# EAGLE design untitled (EAGLE 8.2.2)

## Sheet 1 of 2
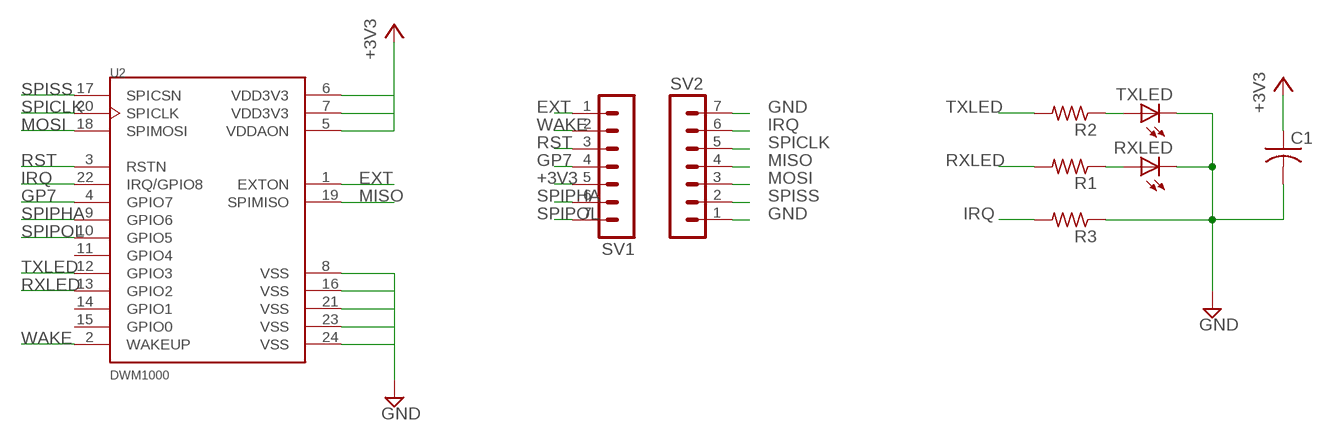
[diagram p0: schematic, sheet 1]

### Parts
C1  C-USC1206  [C1206]
R1  R-US_R1206  [R1206]
R2  R-US_R1206  [R1206]
R3  R-US_R1206  [R1206]
RXLED  LEDSMT1206  [1206]
SV1  MA07-1  [MA07-1]
SV2  MA07-1  [MA07-1]
TXLED  LEDSMT1206  [1206]
U2  DWM1000  [XCVR_DWM1000]

### Nets
+3V3: C1.1 SV1.5 U2.5(VDDAON) U2.6(VDD3V3) U2.7(VDD3V3)
EXT: SV1.1 U2.1(EXTON)
GND: C1.2 R3.1 RXLED.C SV2.1 SV2.7 TXLED.C U2.8(VSS) U2.16(VSS) U2.21(VSS) U2.23(VSS) U2.24(VSS)
GP7: SV1.4 U2.4(GPIO7)
IRQ: R3.2 SV2.6 U2.22(IRQ/GPIO8)
MISO: SV2.4 U2.19(SPIMISO)
MOSI: SV2.3 U2.18(SPIMOSI)
N$1: R1.1 RXLED.A
N$2: R2.1 TXLED.A
RST: SV1.3 U2.3(RSTN)
RXLED: R1.2 U2.13(GPIO2)
SPICLK: SV2.5 U2.20(SPICLK)
SPIPHA: SV1.6 U2.9(GPIO6)
SPIPOL: SV1.7 U2.10(GPIO5)
SPISS: SV2.2 U2.17(SPICSN)
TXLED: R2.2 U2.12(GPIO3)
WAKE: SV1.2 U2.2(WAKEUP)
Unconnected: U2.11(GPIO4) U2.14(GPIO1) U2.15(GPIO0)

## Sheet 2 of 2

## Library data of the parts
C1 = rcl:C-US: CAPACITOR, American symbol
R1-R3 = rcl:R-US_: RESISTOR, American symbol
RXLED TXLED = led:LED: LED OSRAM: - CHIPLED LG R971, LG N971, LY N971, LG Q971, LY Q971, LO R971, LY R971 LH N974, LH R974 LS Q976, LO Q976, LY Q976 LO Q996 - Hyper CHIPLED LW Q18S LB Q993, LB Q99A, LB R99A - SideLED LS A670, LO A670, LY A670, LG A670, LP A670 LB A673, LV A673, LT A673, LW A673 LH A674 LY A675 LS A676, LA A676, LO A676, LY A676, LW A676 LS A679, LY A679, LG A679 - Hyper Micro SIDELED® LS Y876, LA Y876, LO Y876, LY Y876 LT Y87S - SmartLED LW L88C, LW L88S LB L89C, LB L89S, LG L890 LS L89K, LO L89K, LY L89K LS L896, LA L896, LO L896, LY L896 - TOPLED LS T670, LO T670, LY T670, LG T670, LP T670 LSG T670, LSP T670, LSY T670, LOP T670, LYG T670 LG T671, LOG T671, LSG T671 LB T673, LV T673, LT T673, LW T673 LH T674 LS T676, LA T676, LO T676, LY T676, LB T676, LH T676, LSB T676, LW T676 LB T67C, LV T67C, LT T67C, LS T67K, LO T67K, LY T67K, LW E67C LS E67B, LA E67B, LO E67B, LY E67B, LB E67C, LV E67C, LT E67C LW T67C LS T679, LY T679, LG T679 LS T770, LO T770, LY T770, LG T770, LP T770 LB T773, LV T773, LT T773, LW T773 LH T774 LS E675, LA E675, LY E675, LS T675 LS T776, LA T776, LO T776, LY T776, LB T776 LHGB T686 LT T68C, LB T68C - Hyper Mini TOPLED® LB M676 - Mini TOPLED Santana® LG M470 LS M47K, LO M47K, LY M47K Source: http://www.osram.convergy.de LUXEON: - LUMILED® LXK2-PW12-R00, LXK2-PW12-S00, LXK2-PW14-U00, LXK2-PW14-V00 LXK2-PM12-R00, LXK2-PM12-S00, LXK2-PM14-U00 LXK2-PE12-Q00, LXK2-PE12-R00, LXK2-PE12-S00, LXK2-PE14-T00, LXK2-PE14-U00 LXK2-PB12-K00, LXK2-PB12-L00, LXK2-PB12-M00, LXK2-PB14-N00, LXK2-PB14-P00, LXK2-PB14-Q00 LXK2-PR12-L00, LXK2-PR12-M00, LXK2-PR14-Q00, LXK2-PR14-R00 LXK2-PD12-Q00, LXK2-PD12-R00, LXK2-PD12-S00 LXK2-PH12-R00, LXK2-PH12-S00 LXK2-PL12-P00, LXK2-PL12-Q00, LXK2-PL12-R00 Source: www.luxeon.com KINGBRIGHT: KA-3528ASYC Source: www.kingbright.com
SV1 SV2 = con-lstb:MA07-1: PIN HEADER; OC_FARNELL: unknown; OC_NEWARK: unknown
U2 = DWM1000:DWM1000: Mod Ieee802.15.4-2011 Uwb Txrx; AVAILABILITY: Good; DESCRIPTION: Mod Ieee802.15.4-2011 Uwb Txrx; MF: Decawave; MP: DWM1000; PACKAGE: None; PRICE: 20.95 USD

## Board
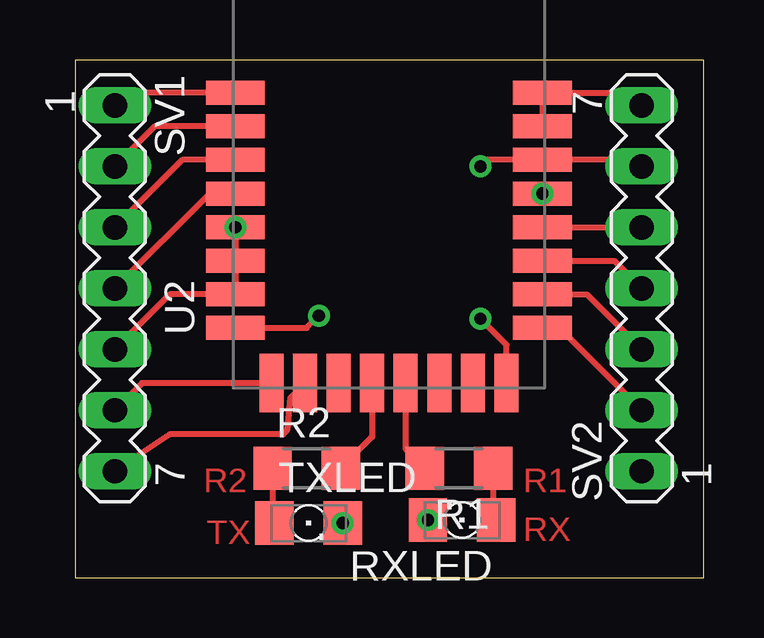
[diagram p1: board, top side]
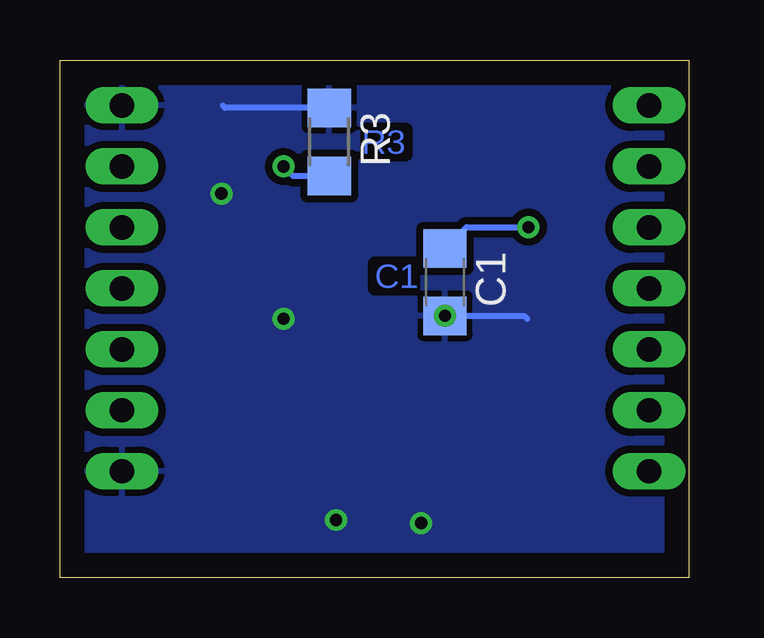
[diagram p2: board, bottom side, seen from below]

Size 26.21 x 21.58 mm. Coordinates in mm from the lower left corner, seen from the top.
Outline: 0,0 26.21,0 26.21,21.58 0,21.58 0,0
Copper layers (1*16): Top 0.035mm / dielectric 1.5mm / Bottom 0.035mm
Design rules "default": minimum track width 6mil, minimum drill 0.35mm, track to track 6mil, track to pad 6mil, pad to pad 6mil, via to via 6mil, smd to smd 6mil, copper to edge 40mil, drill to drill 6mil, minimum pad ring 10mil, minimum via ring 8mil, stop-mask expansion 4mil, vias tented up to drill 0mil, thermal gap 10mil

### Footprints (pad centres in the part's own frame; a part is rotated, then mirrored left to right if it is on the bottom)
C1206 = smd 1.6 x 1.8: 1 -1.4,0; 2 1.4,0
R1206 = smd 1.6 x 1.803: 1 -1.422,0; 2 1.422,0
1206 = smd 1.6 x 1.803: A -1.422,0; C 1.422,0
MA07-1 = drill 1.016 long: 1 -7.62,0; 2 -5.08,0; 3 -2.54,0; 4 0,0; 5 2.54,0; 6 5.08,0; 7 7.62,0
XCVR_DWM1000 = smd 2.45 x 1: 1 -6.4,1.8; 2 -6.4,0.4; 3 -6.4,-1; 4 -6.4,-2.4; 5 -6.4,-3.8; 6 -6.4,-5.2; 7 -6.4,-6.6; 8 -6.4,-8; 17 6.4,-8; 18 6.4,-6.6; 19 6.4,-5.2; 20 6.4,-3.8; 21 6.4,-2.4; 22 6.4,-1; 23 6.4,0.4; 24 6.4,1.8 | smd 1 x 2.45: 9 -4.9,-10.295; 10 -3.5,-10.295; 11 -2.1,-10.295; 12 -0.7,-10.295; 13 0.7,-10.295; 14 2.1,-10.295; 15 3.5,-10.295; 16 4.9,-10.295

### Placement (x,y rotation side)
C1  10.16,12.32 270 bottom
R1  16,4.57 180 top
R2  9.65,4.57 0 top
R3  14.99,18.16 270 bottom
RXLED  16.13,2.41 180 top
SV1  1.65,12.07 270 top
SV2  23.62,12.07 90 top
TXLED  9.73,2.29 0 top
U2  13.08,18.41 0 top

### Tracks (layer width: path | path; a pad name or v marks a point on that pad's centre or on a via)
+3V3  (via drill 0.51)
  Top 0.254: SV1.5 3.94,11.82 U2.7 U2.6 U2.5
  Bottom 0.254: C1.1 9.26,14.61 U2.5
  other vias: 6.68,14.61
EXT
  Top 0.254: U2.1 2.18,20.21 SV1.1
GND  (via drill 0.51)
  Top 0.254: U2.8 9.66,10.41 C1.2 | U2.16 17.98,9.71 v16.89,10.8 | SV2.7 23.09,20.21 U2.24 U2.23
  Bottom 0.254: C1.2 6.86,10.92 6.73,10.8 | R3.1 19.33,19.58 19.43,19.68
  other vias: 10.16,10.92 14.71,2.41 11.15,2.29 19.48,16.02
  pour Bottom (isolate 0.305): 0.38,22.22 30.86,22.22 30.86,20.95 30.86,-1.9 -0.89,-1.9 -0.89,-0.63 -0.89,22.22
GP7
  Top 0.254: U2.4 5.6,16.02 SV1.4
IRQ  (via drill 0.51)
  Top 0.254: SV2.6 23.35,17.41 U2.22 17.16,17.41 v16.89,17.14
  Bottom 0.254: R3.2 16.48,16.74 v16.89,17.14
MISO
  Top 0.254: U2.19 22.47,13.21 SV2.4
MOSI
  Top 0.254: U2.18 21.33,11.82 SV2.3
N$1
  Top 0.254: R1.1 17.42,2.54 RXLED.A
N$2
  Top 0.254: R2.1 8.23,2.37 TXLED.A
RST
  Top 0.254: U2.3 4.46,17.41 SV1.3
RXLED
  Top 0.254: U2.13 13.78,5.37 R1.2
SPICLK
  Top 0.254: U2.20 SV2.5
SPIPHA
  Top 0.254: U2.9 2.79,8.12 SV1.6
SPIPOL
  Top 0.254: U2.10 8.96,7.5 8.83,6.14 8.67,5.98 3.95,5.98 SV1.7
SPISS
  Top 0.254: U2.17 20.19,10.41 SV2.2
TXLED
  Top 0.254: U2.12 12.38,5.88 R2.2
WAKE
  Top 0.254: U2.2 3.32,18.81 SV1.2

### Text on the board
Top: R2 | R1 | TX | RX
Bottom: R3 | C1